# EasyEDA Pro project OSC-chaosheng.eprj, schematic 信号调节电路

## Sheets
1 频率信号调节: Create Date: 2024-10-10; Page Name: 频率信号调节; Project Name: OSC1; Schematic Name: 信号调节电路; Update Date: 2024-10-10; Company: 嘉立创EDA; Page Size: A4; Version: V1.0
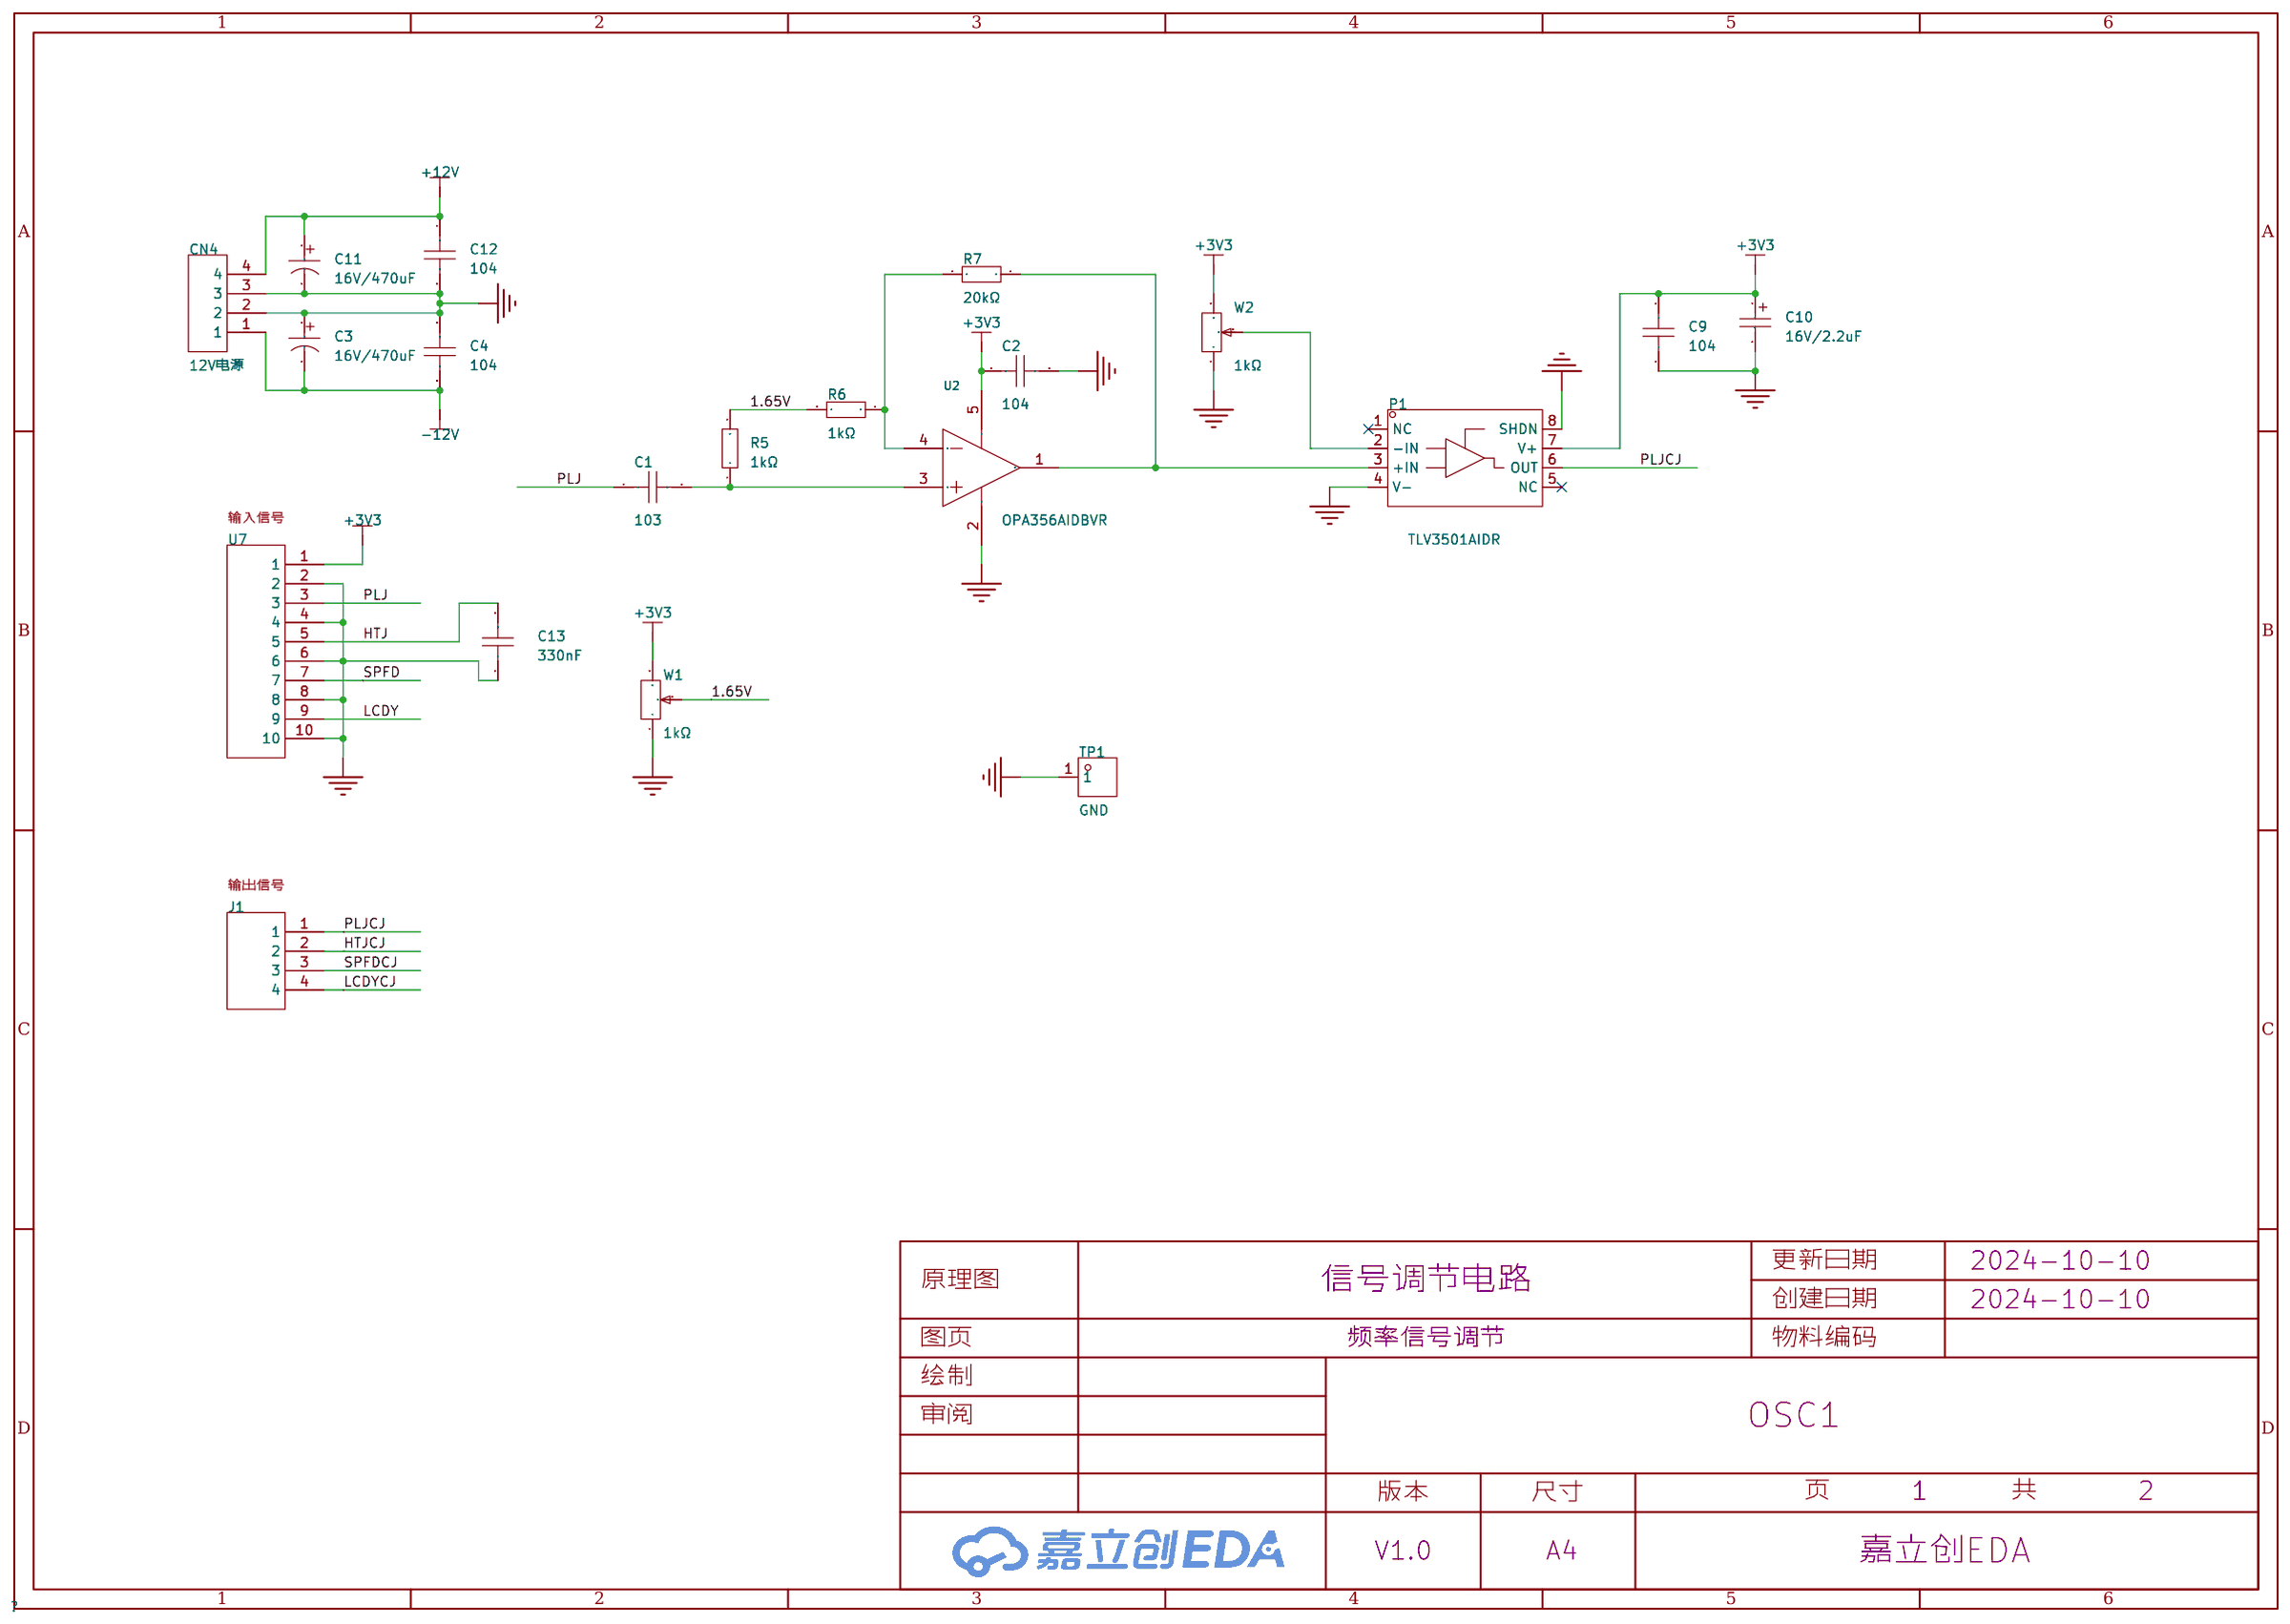
[diagram p2: 频率信号调节]
2 其他信号: Create Date: 2024-09-11; Page Name: 其他信号.信号调节电路; Project Name: OSC; Update Date: 2024-09-11
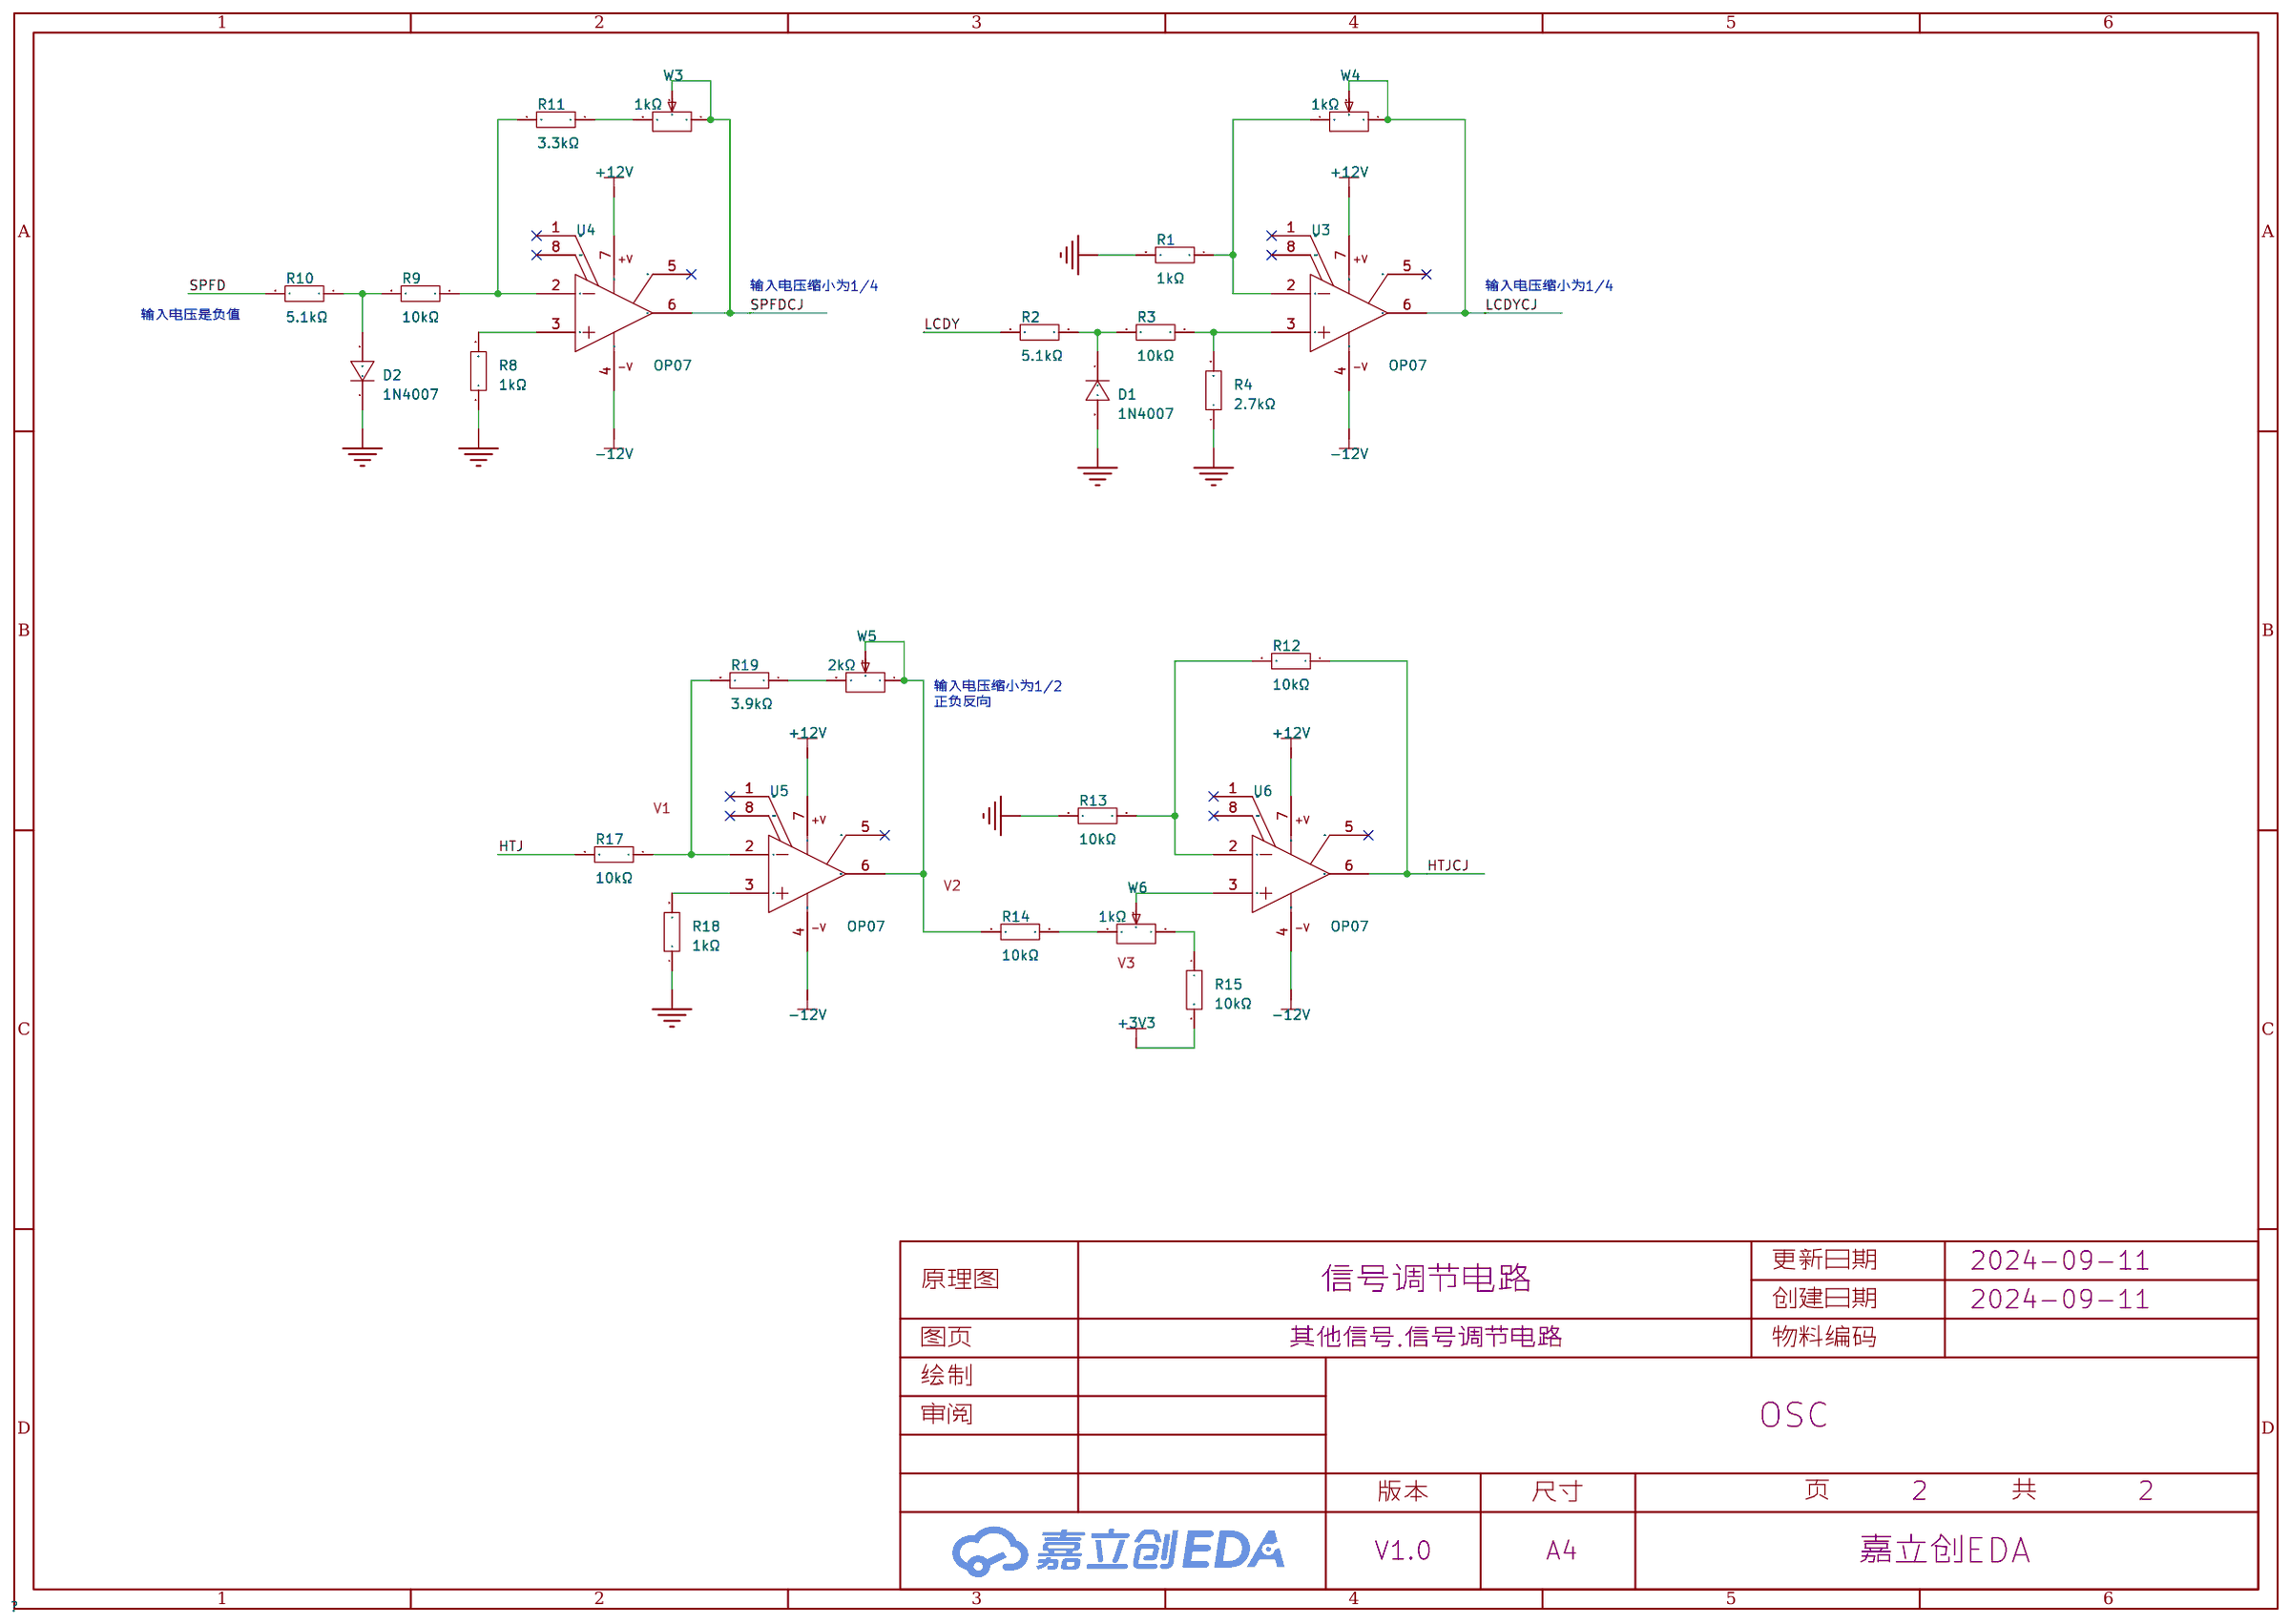
[diagram p3: 其他信号]

## Parts
sheet 其他信号
D1  1N4007  [DO-41_BD2.4-L4.7-P8.70-D0.9-RD]
D2  1N4007  [DO-41_BD2.4-L4.7-P8.70-D0.9-RD]
R1  1kΩ  [RES-TH_BD2.5-L6.5-P10.50-D0.6]
R2  5.1kΩ  [RES-TH_BD2.5-L6.5-P10.50-D0.6]
R3  10kΩ  [RES-TH_BD2.5-L6.5-P10.50-D0.6]
R4  2.7kΩ  [RES-TH_BD2.5-L6.5-P10.50-D0.6]
R8  1kΩ  [RES-TH_BD2.5-L6.5-P10.50-D0.6]
R9  10kΩ  [RES-TH_BD2.5-L6.5-P10.50-D0.6]
R10  5.1kΩ  [RES-TH_BD2.5-L6.5-P10.50-D0.6]
R11  3.3kΩ  [RES-TH_BD2.5-L6.5-P10.50-D0.6]
R12  10kΩ  [RES-TH_BD2.5-L6.5-P10.50-D0.6]
R13  10kΩ  [RES-TH_BD2.5-L6.5-P10.50-D0.6]
R14  10kΩ  [RES-TH_BD2.5-L6.5-P10.50-D0.6]
R15  10kΩ  [RES-TH_BD2.5-L6.5-P10.50-D0.6]
R17  10kΩ  [RES-TH_BD2.5-L6.5-P10.50-D0.6]
R18  1kΩ  [RES-TH_BD2.5-L6.5-P10.50-D0.6]
R19  3.9kΩ  [RES-TH_BD2.5-L6.5-P10.50-D0.6]
U3  OP07  [DIP-8_L8.8-W6.4-P2.54-LS7.6-BL]
U4  OP07  [DIP-8_L8.8-W6.4-P2.54-LS7.6-BL]
U5  OP07  [DIP-8_L8.8-W6.4-P2.54-LS7.6-BL]
U6  OP07  [DIP-8_L8.8-W6.4-P2.54-LS7.6-BL]
W3  1kΩ  [RES-ADJ-TH_3296W]
W4  1kΩ  [RES-ADJ-TH_3296W]
W5  2kΩ  [RES-ADJ-TH_3296W]
W6  1kΩ  [RES-ADJ-TH_3296W]
sheet 频率信号调节
C1  103  [CAP-TH_L7.2-W4.0-P5.00-D0.5]
C2  104  [CAP-TH_L7.2-W4.0-P5.00-D0.5]
C3  16V/470uF  [CAP-TH_BD8.0-P3.50-D0.6-FD]
C4  104  [cap-th_l7.2-w4.0-p5.00-d0.5]
C9  104  [CAP-TH_L7.2-W4.0-P5.00-D0.5]
C10  16V/2.2uF  [CASE-A_3216]
C11  16V/470uF  [CAP-TH_BD8.0-P3.50-D0.6-FD]
C12  104  [cap-th_l7.2-w4.0-p5.00-d0.5]
C13  330nF  [C0603]
CN4  12V电源  [CONN-TH_4P-P2.54_A2510S-4P]
J1  -  [CH2.54-4插座]
P1  TLV3501AIDR  [SOP-8_L4.9-W3.9-P1.27-LS6.0-BL]
R5  1kΩ  [RES-TH_BD2.5-L6.5-P10.50-D0.6]
R6  1kΩ  [RES-TH_BD2.5-L6.5-P10.50-D0.6]
R7  20kΩ  [RES-TH_BD2.5-L6.5-P10.50-D0.6]
TP1  GND  [TESTPOINT-TH_BD3.2]
U2  OPA356AIDBVR  [SOT-23-5_L3.0-W1.7-P0.95-LS2.8-BR]
U7  -  [CH2.54-10插座]
W1  1kΩ  [RES-ADJ-TH_3296W]
W2  1kΩ  [RES-ADJ-TH_3296W]

## Library data of the parts
D1 D2 = 1N4007: Supplier: LCSC; Supplier Part: C402311; Supplier Footprint: DO-41; JLCPCB Part Class: 扩展库; Datasheet: https://atta.szlcsc.com/upload/public/pdf/source/20190705/C402311_D2D67FF606A14042155DA6DAFA20C736.pdf; Manufacturer: LGE(鲁光)
R1-R15 R17-R19 = 1/4W电阻: 电阻类型:金属膜电阻;阻值:1kΩ;精度:±1%;功率:250mW;温度系数:±50ppm/℃;; LCSC Part Name: 1kΩ ±1% 250mW; Supplier Part: C57435; Manufacturer: UNI-ROYAL(厚声); Manufacturer Part: MFR0W4F1001A50; Supplier Footprint: 轴向引线; JLCPCB Part Class: Extended Part; Datasheet: https://atta.szlcsc.com/upload/public/pdf/source/20170615/1497511028539.pdf; Supplier: LCSC; Type: 金属膜电阻; Tolerance: ±1%; Power(Watts): 250mW; Temperature Coefficient: ±50ppm/℃
U3-U6 = OP07: 运放类型:-;放大器组数:-;增益带宽积（GBP）:-;压摆率（SR）:-;电源电压:-;各通道供电电流:-;; LCSC Part Name: 非斩波稳零的双极性(双电源供电)运算放大器集成电路; Supplier Part: C507138; Manufacturer: HGSEMI(华冠); Manufacturer Part: OP07N; Supplier Footprint: DIP-8; JLCPCB Part Class: 扩展库; Datasheet: https://atta.szlcsc.com/upload/public/pdf/source/20211018/477D8740EFCD9B37E17BAFAA0BE9F00A.pdf; Supplier: LCSC
W1-W6 = 3296W: 阻值:1kΩ;精度:±10%;温度系数:±100ppm/℃;; LCSC Part Name: 1kΩ ±10%; Supplier Part: C57089; Manufacturer: BOURNS; Manufacturer Part: 3296W-1-102LF; JLCPCB Part Class: Extended Part; Datasheet: https://atta.szlcsc.com/upload/public/pdf/source/20151026/1457707506403.pdf; Supplier: LCSC; Tolerance: ±10%; Temperature Coefficient: ±100ppm/℃
C1 C2 C9 = 104电容: 容值:100nF;精度:±5%;额定电压:100V;工作温度:-40~+105;; LCSC Part Name: 100nF ±5% 100V; Supplier Part: C333827; Manufacturer: HEL鸿志; Manufacturer Part: MES104J2A-7-50R0; Supplier Footprint: 径向引线,P=5mm; JLCPCB Part Class: 扩展库; Datasheet: https://atta.szlcsc.com/upload/public/pdf/source/20190802/C333827_0C3A382E0AFB64319515A56455BE3B3E.pdf; Supplier: LCSC; Tolerance: ±5%; Voltage Rated: 100V; Operating Temperature: -40~+105
C3 C11 = 16V/470uF: 脚间距:3.5mm;电容体直径:8mm;精度:±20%;工作温度:-;额定电压:16V;容值:470uF;工作寿命:2000hrs 105℃;电容体长度:12mm;; Rated Voltage: 16V; Supplier: LCSC; Supplier Part: C28067; Supplier Footprint: 径向引线,8x12mm; JLCPCB Part Class: 扩展库; LCSC Part Name: 470uF 16V; Tolerance: ±20%; Datasheet: https://atta.szlcsc.com/upload/public/pdf/source/20151029/1457707512884.pdf; Manufacturer: CX(承兴); Manufacturer Part: KM477M016F12RR0VH2FP0; L: 12mm; Lead Spacing: 3.5mm; Lifetime @ Temp: 2000hrs 105℃; φD: 8mm
C4 C12 = 104电容: 容值:100nF;精度:±5%;额定电压:100V;工作温度:-40~+105;; LCSC Part Name: 100nF ±5% 100V; Supplier Part: C333827; Manufacturer: HEL鸿志; Manufacturer Part: MES104J2A-7-50R0; Supplier Footprint: 径向引线,P=5mm; JLCPCB Part Class: Extended Part; Datasheet: https://atta.szlcsc.com/upload/public/pdf/source/20190802/C333827_0C3A382E0AFB64319515A56455BE3B3E.pdf; Supplier: LCSC; Tolerance: ±5%; Voltage Rated: 100V; Operating Temperature: -40~+105
C10 = TAJA225K016RNJ: 容值:2.2uF;精度:±10%;额定电压:16V;等效串联电阻:6.5Ω@100kHz;; LCSC Part Name: 2.2uF ±10% 16V; Supplier Part: C7180; Manufacturer: Kyocera AVX; Supplier Footprint: CASE-A-3216; JLCPCB Part Class: Extended Part; Datasheet: https://atta.szlcsc.com/upload/public/pdf/source/20160107/1457707748378.pdf; Supplier: LCSC; Tolerance: ±10%; Rated Voltage: 16V; Equivalent Series Resistance(ESR): 6.5Ω@100kHz; Operating Temperature: -55℃~+125℃
C13 = FCC0603B334K500CT: 容值:330nF;精度:±10%;额定电压:50V;材质(温度系数):X7R;; LCSC Part Name: 330nF ±10% 50V; Supplier Part: C7419419; Manufacturer: FOJAN(富捷); Supplier Footprint: 0603; JLCPCB Part Class: 扩展库; Datasheet: https://atta.szlcsc.com/upload/public/pdf/source/20230926/96CBFEAC228090559554C216363F8731.pdf; Supplier: LCSC; Tolerance: ±10%; Voltage Rated: 50V; Temperature Coefficient: X7R
CN4 = 2.54mm4芯插座: 参考系列:-;间距:2.54mm;插针结构:1x4P;排数:1;每排PIN数:4;行距:-;安装方式:-;触头材质:黄铜;; LCSC Part Name: MX2.54 2510系列 插座 1*4P 2.54mm 直针米黄; Supplier Part: C140769; Manufacturer: Ckmtw(灿科盟); Manufacturer Part: W-2510S04P-0000; Supplier Footprint: 插件,P=2.54mm; JLCPCB Part Class: 扩展库; Datasheet: https://atta.szlcsc.com/upload/public/pdf/source/20180423/C140769_E5973268EE8E03CF1A982B681C4FAED0.pdf; Supplier: LCSC; Pitch: 2.54mm; Pins Structure: 1x4P; Number of Rows: 1; Number of PINs Per Row: 4; Contact Material: 黄铜
J1 = HDR-4P
P1 = TLV3501AIDR: 比较器组数:1;电源电压:2.7V ~ 5.5V, ±1.35V ~ 2.75V;各通道供电电流:5mA;输出类型:CMOS, Push-Pull, Rail-to-Rail, TTL;传播延迟:10ns;; Supplier Part: C43484; Manufacturer: TI(德州仪器); Supplier Footprint: SOP-8_150mil; JLCPCB Part Class: 扩展库; Datasheet: https://atta.szlcsc.com/upload/public/pdf/source/20150319/1457707268212.pdf; Supplier: LCSC; Number of Elements: 1; Supply Voltage（Single）: 2.7V ~ 5.5V, ±1.35V ~ 2.75V; Iq per channel (Typ): 5mA; Output Type: CMOS, Push-Pull, Rail-to-Rail, TTL; Propagation Delay (Max): 10ns; Operating Temperature: -40°C ~ 125°C
TP1 = 测试点: LCSC Part Name: TP-黄色测试点; Supplier Part: C9900007422; Manufacturer Part: TP-黄色测试点; Supplier Footprint: TESTPOINT-TH_BD-2P-P2.00; JLCPCB Part Class: 扩展库; Datasheet: https://atta.szlcsc.comnull; Supplier: LCSC
U2 = OPA356AIDBVR: 放大器组数:1;带宽(-3db):450MHz;输入偏置电流(Ib):3pA;增益带宽积(GBP):200MHz;压摆率(SR):360V/us;轨到轨:轨到轨;; Supplier Part: C183100; Manufacturer: TI(德州仪器); Supplier Footprint: SOT-23-5; JLCPCB Part Class: Extended Part; Datasheet: https://www.ti.com/cn/lit/gpn/opa356; Supplier: LCSC; Number of Circuits: 1; -3db Bandwidth: 450MHz; Current - Input Bias(Ib): 3pA; Gain Bandwidth Product(GBP): 200MHz; Slew Rate(SR): 360V/us; Rail to Rail: 轨到轨; Output Current: 100mA; Operating Temperature: -40℃~+125℃
U7 = HDR-10P

## Nets
1.65V: R5.2 R6.2 W1.2
+3V3: C2.1 C9.1 C10.1 P1.7(V+) R15.2 U2.5(V+) U7.1 W1.3 W2.3
+12V: C11.1 C12.1 CN4.4 U3.7(VCC+) U4.7(VCC+) U5.7(VCC+) U6.7(VCC+)
-12V: C3.2 C4.2 CN4.1 U3.4(VCC-) U4.4(VCC-) U5.4(VCC-) U6.4(VCC-)
GND: C2.2 C3.1 C4.1 C9.2 C10.2 C11.2 C12.2 C13.1 CN4.2 CN4.3 D1.2 D2.1 P1.4(V-) P1.8(SHDN) R1.2 R4.1 R8.1 R13.2 R18.1 TP1.1 U2.2(V-) U7.2 U7.4 U7.6 U7.8 U7.10 W1.1 W2.1
HTJ: C13.2 R17.2 U7.5
HTJCJ: J1.2 R12.1 U6.6(OUT)
LCDY: R2.2 U7.9
LCDYCJ: J1.4 U3.6(OUT) W4.1 W4.2
PLJ: C1.1 U7.3
PLJCJ: J1.1 P1.6(OUT)
SPFD: R10.2 U7.7
SPFDCJ: J1.3 U4.6(OUT) W3.1 W3.2
$1N599: P1.3(+IN) R7.1 U2.1(OUT)
$1N608: C1.2 R5.1 U2.3(IN+)
$1N609: R6.1 R7.2 U2.4(IN-)
$1N620: P1.2(-IN) W2.2
$2N344: D2.2 R9.2 R10.1
$2N350: R11.1 W3.3
$2N352: R8.2 U4.3(IN+)
$2N353: R9.1 R11.2 U4.2(IN-)
$2N682: D1.1 R2.1 R3.2
$2N687: R3.1 R4.2 U3.3(IN+)
$2N689: R1.1 U3.2(IN-) W4.3
$2N1425: R18.2 U5.3(IN+)
$2N1427: R19.1 W5.3
$2N1428: R17.1 R19.2 U5.2(IN-)
$2N1431: U6.3(IN+) W6.2
$2N1432: R14.2 W6.3
$2N1433: R15.1 W6.1
$2N1434: R14.1 U5.6(OUT) W5.1 W5.2
$2N1437: R12.2 R13.1 U6.2(IN-)

Not connected (* = marked no-connect by the designer): P1 1(NC)* 5(NC)*; U3 1(OFFSET N1)* 5(NC)* 8(OFFSET N2)*; U4 1(OFFSET N1)* 5(NC)* 8(OFFSET N2)*; U5 1(OFFSET N1)* 5(NC)* 8(OFFSET N2)*; U6 1(OFFSET N1)* 5(NC)* 8(OFFSET N2)*

## Notes on the sheets
sheet 1
- 输入信号
- 输出信号
sheet 2
- 输入电压缩小为1/4
- 输入电压缩小为1/4
- 输入电压是负值
- 输入电压缩小为1/2
  正负反向
- V1
- V2
- V3
